# EAGLE design lipo-charger-station (EAGLE 6.3)

## Sheet 1 of 2
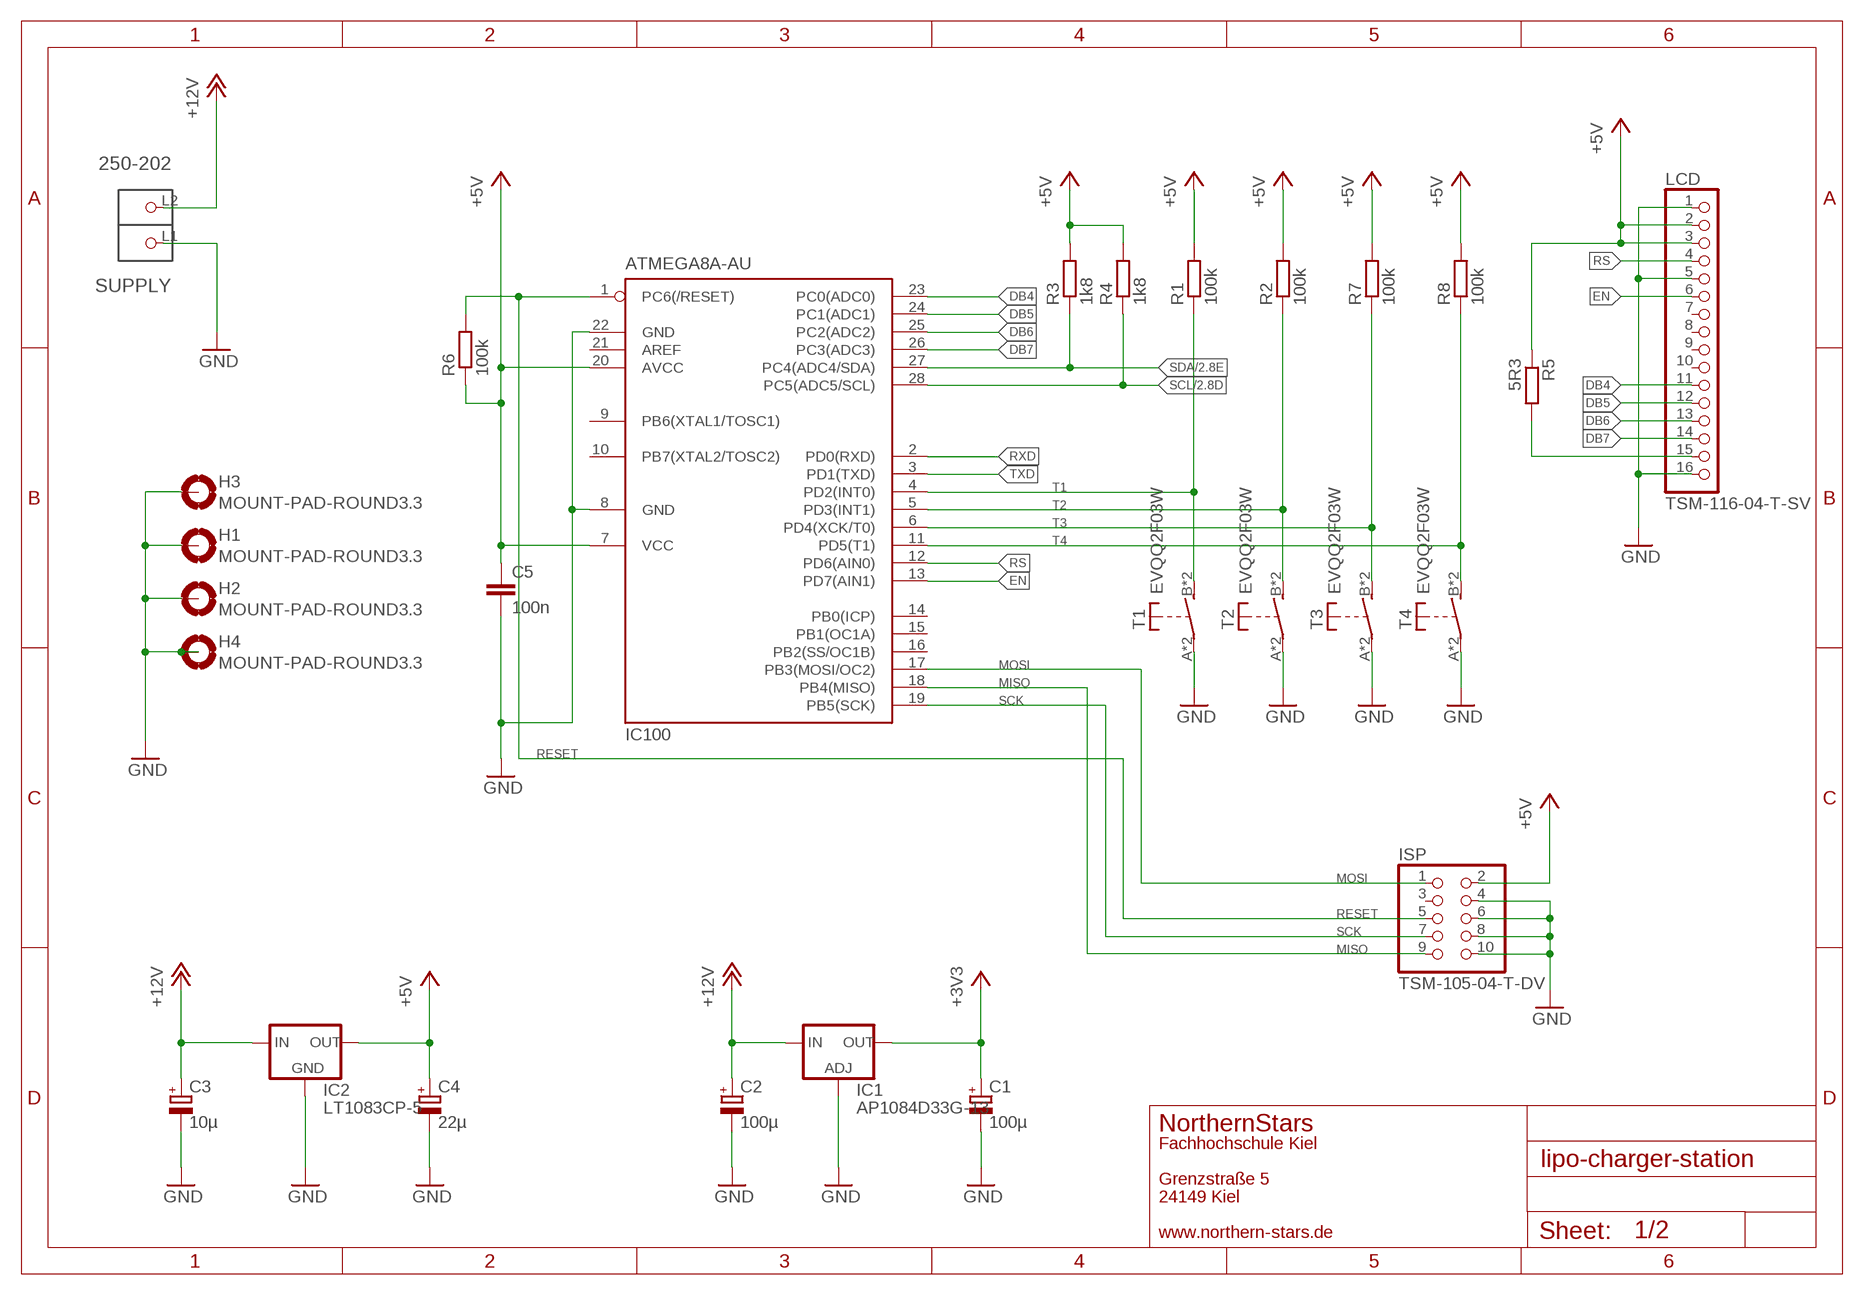
[diagram p0: schematic, sheet 1]

### Parts
C1  100µ  CPOL-EUG  [PANASONIC_G]
C2  100µ  CPOL-EUG  [PANASONIC_G]
C3  10µ  CPOL-EUD  [PANASONIC_D]
C4  22µ  CPOL-EUE  [PANASONIC_E]
C5  100n  C-EUC1206  [C1206]
H1  MOUNT-PAD-ROUND3.3  [3,3-PAD]
H2  MOUNT-PAD-ROUND3.3  [3,3-PAD]
H3  MOUNT-PAD-ROUND3.3  [3,3-PAD]
H4  MOUNT-PAD-ROUND3.3  [3,3-PAD]
IC1  AP1084D33G-13  AP1084  [TO252]
IC2  LT1083CP-5  LT108XCP  [TO3P]
IC100  ATMEGA8A-AU  MEGA8-P  [DIL28-3]
ISP  TSM-105-04-T-DV  PINHD-2X05_2.54-SMD  [2X05SMD]
LCD  TSM-116-04-T-SV  PINHD-1X16_2.54-SMD  [1X16SMD]
R1  100k  R-EU_R1206  [R1206]
R2  100k  R-EU_R1206  [R1206]
R3  1k8  R-EU_R1206  [R1206]
R4  1k8  R-EU_R1206  [R1206]
R5  5R3  R-EU_R1206  [R1206]
R6  100k  R-EU_R1206  [R1206]
R7  100k  R-EU_R1206  [R1206]
R8  100k  R-EU_R1206  [R1206]
SUPPLY  250-202  [P-250-202]
T1  EVQQ2F03W  SMD_TASTER_PANASONIC  [SMD_TASTER_PANASONIC]
T2  EVQQ2F03W  SMD_TASTER_PANASONIC  [SMD_TASTER_PANASONIC]
T3  EVQQ2F03W  SMD_TASTER_PANASONIC  [SMD_TASTER_PANASONIC]
T4  EVQQ2F03W  SMD_TASTER_PANASONIC  [SMD_TASTER_PANASONIC]

### Nets
+3V3: C1.+ IC1.3(OUT) ; also sheet 2
+5V: C4.+ C5.1 IC2.2(OUT) IC100.7(VCC) IC100.20(AVCC) ISP.2 LCD.2 LCD.3 R1.2 R2.2 R3.2 R4.2 R5.1 R6.1 R7.2 R8.2 ; also sheet 2
+12V: C2.+ C3.+ IC1.2(IN) IC2.3(IN) SUPPLY.L2(P2)
DB4: IC100.23(PC0(ADC0)) LCD.11
DB5: IC100.24(PC1(ADC1)) LCD.12
DB6: IC100.25(PC2(ADC2)) LCD.13
DB7: IC100.26(PC3(ADC3)) LCD.14
EN: IC100.13(PD7(AIN1)) LCD.6
GND: C1.- C2.- C3.- C4.- C5.2 H1.B3,3(MOUNT) H2.B3,3(MOUNT) H3.B3,3(MOUNT) H4.B3,3(MOUNT) IC1.1(ADJ) IC2.1(GND) IC100.8(GND) IC100.22(GND) ISP.4 ISP.6 ISP.8 ISP.10 LCD.1 LCD.5 LCD.16 SUPPLY.L1(P1) T1.A'(P) T1.A(P) T2.A'(P) T2.A(P) T3.A'(P) T3.A(P) T4.A'(P) T4.A(P) ; also sheet 2
LEDA: LCD.15 R5.2
MISO: IC100.18(PB4(MISO)) ISP.9
MOSI: IC100.17(PB3(MOSI/OC2)) ISP.1
RESET: IC100.1(PC6(/RESET)) ISP.5 R6.2
RS: IC100.12(PD6(AIN0)) LCD.4
RXD: IC100.2(PD0(RXD))
SCK: IC100.19(PB5(SCK)) ISP.7
SCL: IC100.28(PC5(ADC5/SCL)) R4.1 ; also sheet 2
SDA: IC100.27(PC4(ADC4/SDA)) R3.1 ; also sheet 2
T1: IC100.4(PD2(INT0)) R1.1 T1.B'(S) T1.B(S)
T2: IC100.5(PD3(INT1)) R2.1 T2.B'(S) T2.B(S)
T3: IC100.6(PD4(XCK/T0)) R7.1 T3.B'(S) T3.B(S)
T4: IC100.11(PD5(T1)) R8.1 T4.B'(S) T4.B(S)
TXD: IC100.3(PD1(TXD))
Unconnected: IC100.9(PB6(XTAL1/TOSC1)) IC100.10(PB7(XTAL2/TOSC2)) IC100.14(PB0(ICP)) IC100.15(PB1(OC1A)) IC100.16(PB2(SS/OC1B)) IC100.21(AREF) ISP.3 LCD.7 LCD.8 LCD.9 LCD.10

### Notes on the sheet
- NorthernStars
- Fachhochschule Kiel
- Grenzstraße 5
- 24149 Kiel
- www.northern-stars.de

## Sheet 2 of 2
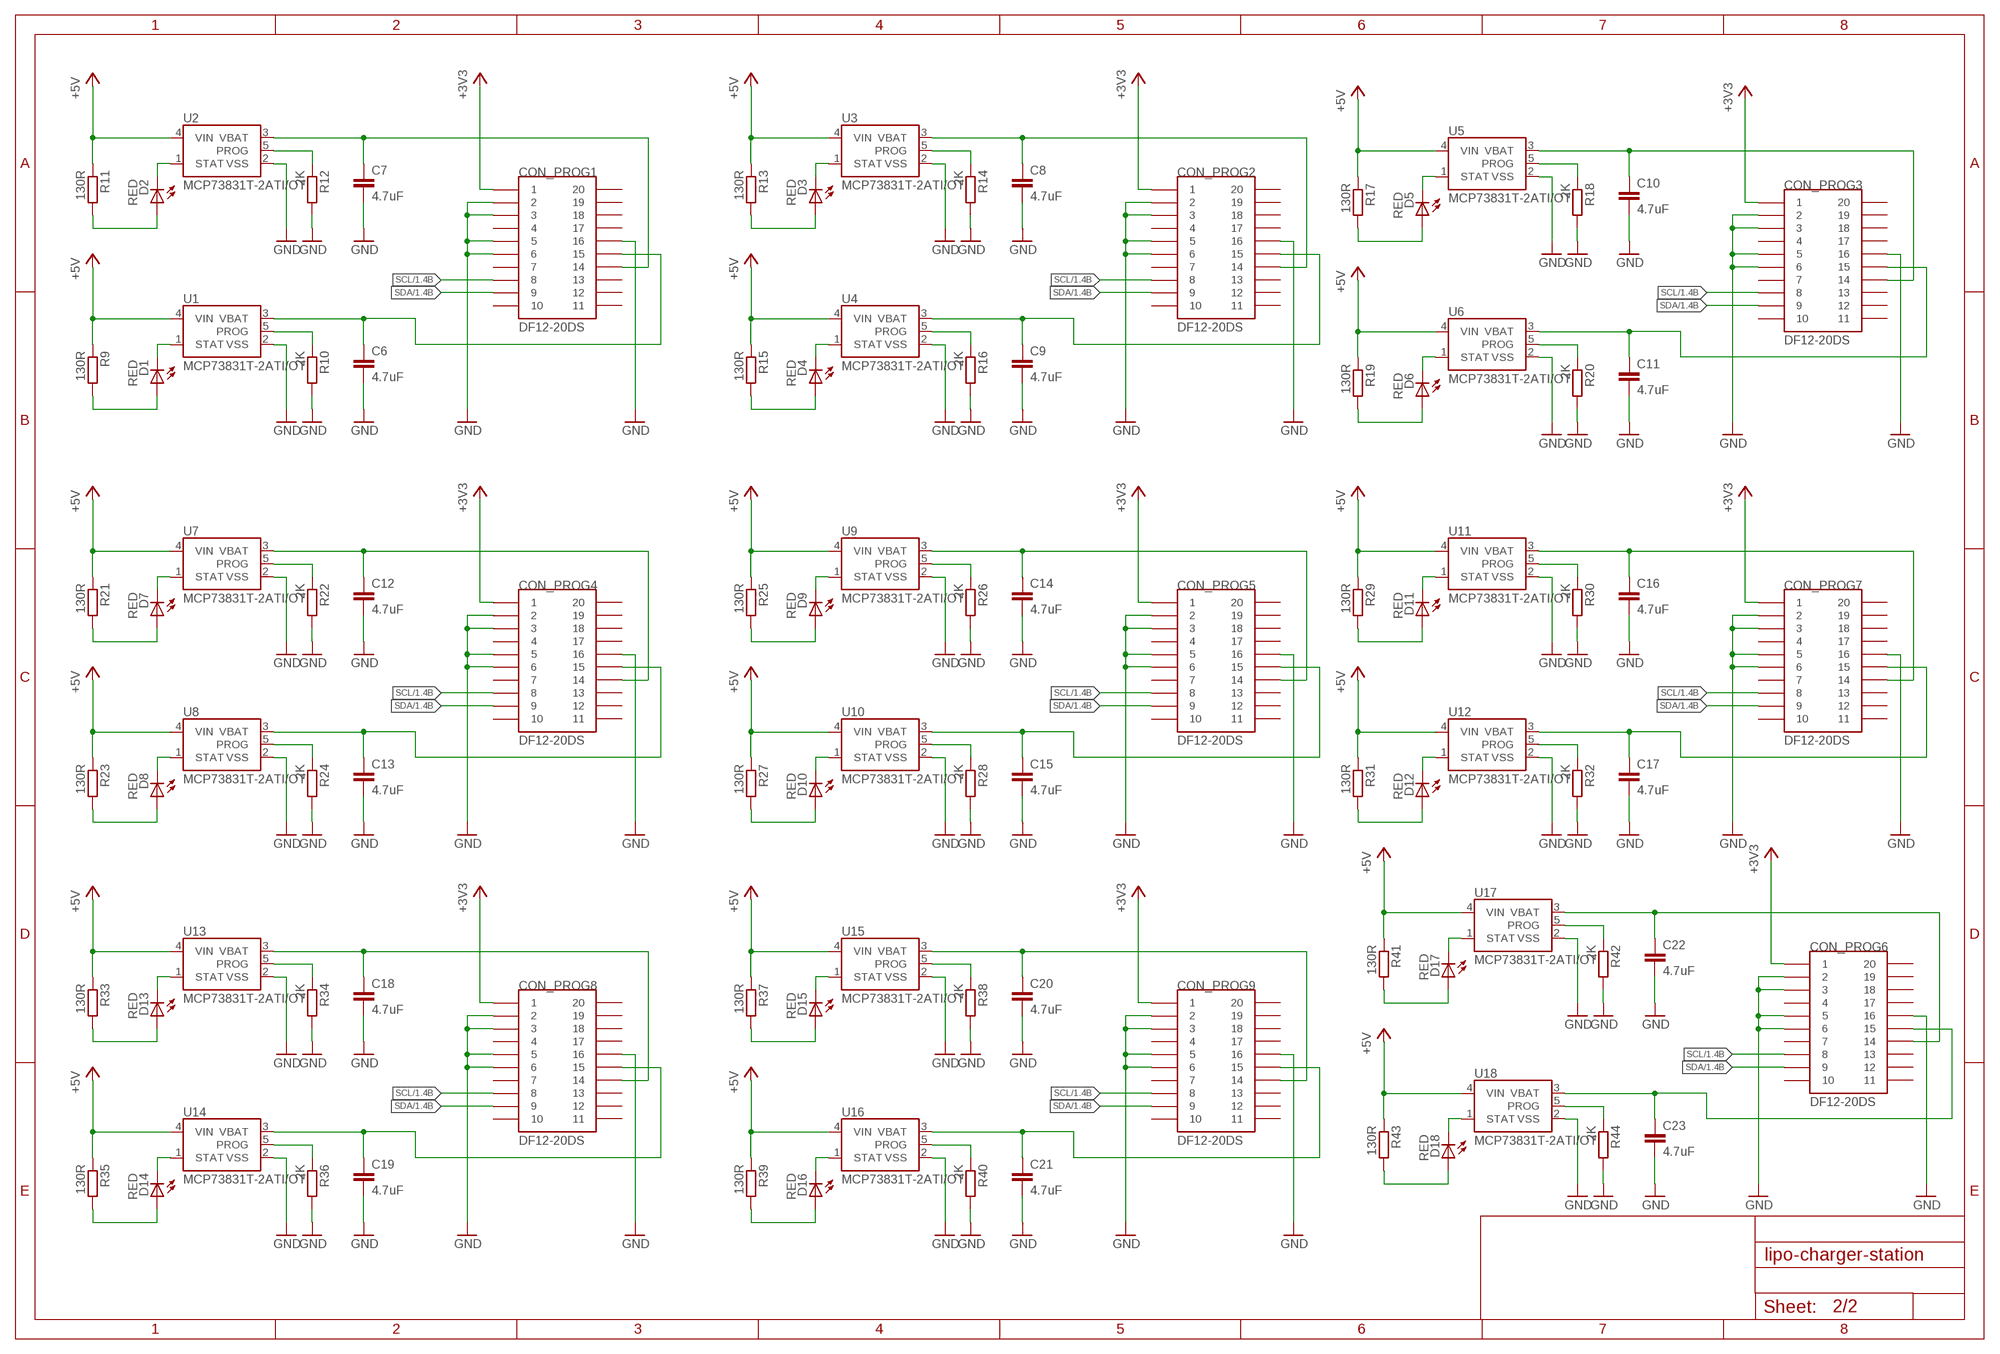
[diagram p1: schematic, sheet 2]

### Parts
C6  4.7uF  C-EUC1206  [C1206]
C7  4.7uF  C-EUC1206  [C1206]
C8  4.7uF  C-EUC1206  [C1206]
C9  4.7uF  C-EUC1206  [C1206]
C10  4.7uF  C-EUC1206  [C1206]
C11  4.7uF  C-EUC1206  [C1206]
C12  4.7uF  C-EUC1206  [C1206]
C13  4.7uF  C-EUC1206  [C1206]
C14  4.7uF  C-EUC1206  [C1206]
C15  4.7uF  C-EUC1206  [C1206]
C16  4.7uF  C-EUC1206  [C1206]
C17  4.7uF  C-EUC1206  [C1206]
C18  4.7uF  C-EUC1206  [C1206]
C19  4.7uF  C-EUC1206  [C1206]
C20  4.7uF  C-EUC1206  [C1206]
C21  4.7uF  C-EUC1206  [C1206]
C22  4.7uF  C-EUC1206  [C1206]
C23  4.7uF  C-EUC1206  [C1206]
CON_PROG1  DF12-20DS  [DF12-20DS]
CON_PROG2  DF12-20DS  [DF12-20DS]
CON_PROG3  DF12-20DS  [DF12-20DS]
CON_PROG4  DF12-20DS  [DF12-20DS]
CON_PROG5  DF12-20DS  [DF12-20DS]
CON_PROG6  DF12-20DS  [DF12-20DS]
CON_PROG7  DF12-20DS  [DF12-20DS]
CON_PROG8  DF12-20DS  [DF12-20DS]
CON_PROG9  DF12-20DS  [DF12-20DS]
D1  RED  LEDCHIPLED_1206  [CHIPLED_1206]
D2  RED  LEDCHIPLED_1206  [CHIPLED_1206]
D3  RED  LEDCHIPLED_1206  [CHIPLED_1206]
D4  RED  LEDCHIPLED_1206  [CHIPLED_1206]
D5  RED  LEDCHIPLED_1206  [CHIPLED_1206]
D6  RED  LEDCHIPLED_1206  [CHIPLED_1206]
D7  RED  LEDCHIPLED_1206  [CHIPLED_1206]
D8  RED  LEDCHIPLED_1206  [CHIPLED_1206]
D9  RED  LEDCHIPLED_1206  [CHIPLED_1206]
D10  RED  LEDCHIPLED_1206  [CHIPLED_1206]
D11  RED  LEDCHIPLED_1206  [CHIPLED_1206]
D12  RED  LEDCHIPLED_1206  [CHIPLED_1206]
D13  RED  LEDCHIPLED_1206  [CHIPLED_1206]
D14  RED  LEDCHIPLED_1206  [CHIPLED_1206]
D15  RED  LEDCHIPLED_1206  [CHIPLED_1206]
D16  RED  LEDCHIPLED_1206  [CHIPLED_1206]
D17  RED  LEDCHIPLED_1206  [CHIPLED_1206]
D18  RED  LEDCHIPLED_1206  [CHIPLED_1206]
R9  130R  R-EU_R1206  [R1206]
R10  2K  R-EU_R1206  [R1206]
R11  130R  R-EU_R1206  [R1206]
R12  2K  R-EU_R1206  [R1206]
R13  130R  R-EU_R1206  [R1206]
R14  2K  R-EU_R1206  [R1206]
R15  130R  R-EU_R1206  [R1206]
R16  2K  R-EU_R1206  [R1206]
R17  130R  R-EU_R1206  [R1206]
R18  2K  R-EU_R1206  [R1206]
R19  130R  R-EU_R1206  [R1206]
R20  2K  R-EU_R1206  [R1206]
R21  130R  R-EU_R1206  [R1206]
R22  2K  R-EU_R1206  [R1206]
R23  130R  R-EU_R1206  [R1206]
R24  2K  R-EU_R1206  [R1206]
R25  130R  R-EU_R1206  [R1206]
R26  2K  R-EU_R1206  [R1206]
R27  130R  R-EU_R1206  [R1206]
R28  2K  R-EU_R1206  [R1206]
R29  130R  R-EU_R1206  [R1206]
R30  2K  R-EU_R1206  [R1206]
R31  130R  R-EU_R1206  [R1206]
R32  2K  R-EU_R1206  [R1206]
R33  130R  R-EU_R1206  [R1206]
R34  2K  R-EU_R1206  [R1206]
R35  130R  R-EU_R1206  [R1206]
R36  2K  R-EU_R1206  [R1206]
R37  130R  R-EU_R1206  [R1206]
R38  2K  R-EU_R1206  [R1206]
R39  130R  R-EU_R1206  [R1206]
R40  2K  R-EU_R1206  [R1206]
R41  130R  R-EU_R1206  [R1206]
R42  2K  R-EU_R1206  [R1206]
R43  130R  R-EU_R1206  [R1206]
R44  2K  R-EU_R1206  [R1206]
U1  MCP73831T-2ATI/OT  MCP73831  [SOT23-5]
U2  MCP73831T-2ATI/OT  MCP73831  [SOT23-5]
U3  MCP73831T-2ATI/OT  MCP73831  [SOT23-5]
U4  MCP73831T-2ATI/OT  MCP73831  [SOT23-5]
U5  MCP73831T-2ATI/OT  MCP73831  [SOT23-5]
U6  MCP73831T-2ATI/OT  MCP73831  [SOT23-5]
U7  MCP73831T-2ATI/OT  MCP73831  [SOT23-5]
U8  MCP73831T-2ATI/OT  MCP73831  [SOT23-5]
U9  MCP73831T-2ATI/OT  MCP73831  [SOT23-5]
U10  MCP73831T-2ATI/OT  MCP73831  [SOT23-5]
U11  MCP73831T-2ATI/OT  MCP73831  [SOT23-5]
U12  MCP73831T-2ATI/OT  MCP73831  [SOT23-5]
U13  MCP73831T-2ATI/OT  MCP73831  [SOT23-5]
U14  MCP73831T-2ATI/OT  MCP73831  [SOT23-5]
U15  MCP73831T-2ATI/OT  MCP73831  [SOT23-5]
U16  MCP73831T-2ATI/OT  MCP73831  [SOT23-5]
U17  MCP73831T-2ATI/OT  MCP73831  [SOT23-5]
U18  MCP73831T-2ATI/OT  MCP73831  [SOT23-5]

### Nets
+3V3: CON_PROG1.1 CON_PROG2.1 CON_PROG3.1 CON_PROG4.1 CON_PROG5.1 CON_PROG6.1 CON_PROG7.1 CON_PROG8.1 CON_PROG9.1 ; also sheet 1
+5V: R9.1 R11.1 R13.1 R15.1 R17.1 R19.1 R21.1 R23.1 R25.1 R27.1 R29.1 R31.1 R33.1 R35.1 R37.1 R39.1 R41.1 R43.1 U1.4(VIN) U2.4(VIN) U3.4(VIN) U4.4(VIN) U5.4(VIN) U6.4(VIN) U7.4(VIN) U8.4(VIN) U9.4(VIN) U10.4(VIN) U11.4(VIN) U12.4(VIN) U13.4(VIN) U14.4(VIN) U15.4(VIN) U16.4(VIN) U17.4(VIN) U18.4(VIN) ; also sheet 1
B1_BAT1+: C7.1 CON_PROG1.14 U2.3(VBAT)
B1_BAT1+1: C8.1 CON_PROG2.14 U3.3(VBAT)
B1_BAT1+3: C10.1 CON_PROG3.14 U5.3(VBAT)
B1_BAT1+4: C12.1 CON_PROG4.14 U7.3(VBAT)
B1_BAT1+5: C16.1 CON_PROG7.14 U11.3(VBAT)
B1_BAT1+6: C14.1 CON_PROG5.14 U9.3(VBAT)
B1_BAT1+7: C22.1 CON_PROG6.14 U17.3(VBAT)
B1_BAT1+9: C18.1 CON_PROG8.14 U13.3(VBAT)
B1_BAT1+10: C20.1 CON_PROG9.14 U15.3(VBAT)
B1_BAT2+: C6.1 CON_PROG1.15 U1.3(VBAT)
B1_BAT2+1: C9.1 CON_PROG2.15 U4.3(VBAT)
B1_BAT2+2: C11.1 CON_PROG3.15 U6.3(VBAT)
B1_BAT2+3: C13.1 CON_PROG4.15 U8.3(VBAT)
B1_BAT2+4: C15.1 CON_PROG5.15 U10.3(VBAT)
B1_BAT2+5: C17.1 CON_PROG7.15 U12.3(VBAT)
B1_BAT2+6: C19.1 CON_PROG8.15 U14.3(VBAT)
B1_BAT2+7: C21.1 CON_PROG9.15 U16.3(VBAT)
B1_BAT2+8: C23.1 CON_PROG6.15 U18.3(VBAT)
GND: C6.2 C7.2 C8.2 C9.2 C10.2 C11.2 C12.2 C13.2 C14.2 C15.2 C16.2 C17.2 C18.2 C19.2 C20.2 C21.2 C22.2 C23.2 CON_PROG1.2 CON_PROG1.3 CON_PROG1.5 CON_PROG1.6 CON_PROG1.16 CON_PROG2.2 CON_PROG2.3 CON_PROG2.5 CON_PROG2.6 CON_PROG2.16 CON_PROG3.2 CON_PROG3.3 CON_PROG3.5 CON_PROG3.6 CON_PROG3.16 CON_PROG4.2 CON_PROG4.3 CON_PROG4.5 CON_PROG4.6 CON_PROG4.16 CON_PROG5.2 CON_PROG5.3 CON_PROG5.5 CON_PROG5.6 CON_PROG5.16 CON_PROG6.2 CON_PROG6.3 CON_PROG6.5 CON_PROG6.6 CON_PROG6.16 CON_PROG7.2 CON_PROG7.3 CON_PROG7.5 CON_PROG7.6 CON_PROG7.16 CON_PROG8.2 CON_PROG8.3 CON_PROG8.5 CON_PROG8.6 CON_PROG8.16 CON_PROG9.2 CON_PROG9.3 CON_PROG9.5 CON_PROG9.6 CON_PROG9.16 R10.2 R12.2 R14.2 R16.2 R18.2 R20.2 R22.2 R24.2 R26.2 R28.2 R30.2 R32.2 R34.2 R36.2 R38.2 R40.2 R42.2 R44.2 U1.2(VSS) U2.2(VSS) U3.2(VSS) U4.2(VSS) U5.2(VSS) U6.2(VSS) U7.2(VSS) U8.2(VSS) U9.2(VSS) U10.2(VSS) U11.2(VSS) U12.2(VSS) U13.2(VSS) U14.2(VSS) U15.2(VSS) U16.2(VSS) U17.2(VSS) U18.2(VSS) ; also sheet 1
N$1: D2.A R11.2
N$2: D1.A R9.2
N$3: D3.A R13.2
N$4: D4.A R15.2
N$5: D5.A R17.2
N$6: D6.A R19.2
N$7: D7.A R21.2
N$8: D8.A R23.2
N$9: D9.A R25.2
N$10: D10.A R27.2
N$11: D11.A R29.2
N$12: D12.A R31.2
N$13: D13.A R33.2
N$14: D14.A R35.2
N$15: D15.A R37.2
N$16: D16.A R39.2
N$17: D17.A R41.2
N$18: D18.A R43.2
PROG: R12.1 U2.5(PROG)
PROG1: R10.1 U1.5(PROG)
PROG2: R14.1 U3.5(PROG)
PROG3: R16.1 U4.5(PROG)
PROG4: R18.1 U5.5(PROG)
PROG5: R20.1 U6.5(PROG)
PROG6: R22.1 U7.5(PROG)
PROG7: R24.1 U8.5(PROG)
PROG8: R26.1 U9.5(PROG)
PROG9: R28.1 U10.5(PROG)
PROG10: R30.1 U11.5(PROG)
PROG11: R32.1 U12.5(PROG)
PROG12: R34.1 U13.5(PROG)
PROG13: R36.1 U14.5(PROG)
PROG14: R38.1 U15.5(PROG)
PROG15: R40.1 U16.5(PROG)
PROG16: R42.1 U17.5(PROG)
PROG17: R44.1 U18.5(PROG)
SCL: CON_PROG1.8 CON_PROG2.8 CON_PROG3.8 CON_PROG4.8 CON_PROG5.8 CON_PROG6.8 CON_PROG7.8 CON_PROG8.8 CON_PROG9.8 ; also sheet 1
SDA: CON_PROG1.9 CON_PROG2.9 CON_PROG3.9 CON_PROG4.9 CON_PROG5.9 CON_PROG6.9 CON_PROG7.9 CON_PROG8.9 CON_PROG9.9 ; also sheet 1
STAT: D2.C U2.1(STAT)
STAT1: D1.C U1.1(STAT)
STAT2: D3.C U3.1(STAT)
STAT3: D4.C U4.1(STAT)
STAT4: D5.C U5.1(STAT)
STAT5: D6.C U6.1(STAT)
STAT6: D7.C U7.1(STAT)
STAT7: D8.C U8.1(STAT)
STAT8: D9.C U9.1(STAT)
STAT9: D10.C U10.1(STAT)
STAT10: D11.C U11.1(STAT)
STAT11: D12.C U12.1(STAT)
STAT12: D13.C U13.1(STAT)
STAT13: D14.C U14.1(STAT)
STAT14: D15.C U15.1(STAT)
STAT15: D16.C U16.1(STAT)
STAT16: D17.C U17.1(STAT)
STAT17: D18.C U18.1(STAT)
Unconnected: CON_PROG1.4 CON_PROG1.7 CON_PROG1.10 CON_PROG1.11 CON_PROG1.12 CON_PROG1.13 CON_PROG1.17 CON_PROG1.18 CON_PROG1.19 CON_PROG1.20 CON_PROG2.4 CON_PROG2.7 CON_PROG2.10 CON_PROG2.11 CON_PROG2.12 CON_PROG2.13 CON_PROG2.17 CON_PROG2.18 CON_PROG2.19 CON_PROG2.20 CON_PROG3.4 CON_PROG3.7 CON_PROG3.10 CON_PROG3.11 CON_PROG3.12 CON_PROG3.13 CON_PROG3.17 CON_PROG3.18 CON_PROG3.19 CON_PROG3.20 CON_PROG4.4 CON_PROG4.7 CON_PROG4.10 CON_PROG4.11 CON_PROG4.12 CON_PROG4.13 CON_PROG4.17 CON_PROG4.18 CON_PROG4.19 CON_PROG4.20 CON_PROG5.4 CON_PROG5.7 CON_PROG5.10 CON_PROG5.11 CON_PROG5.12 CON_PROG5.13 CON_PROG5.17 CON_PROG5.18 CON_PROG5.19 CON_PROG5.20 CON_PROG6.4 CON_PROG6.7 CON_PROG6.10 CON_PROG6.11 CON_PROG6.12 CON_PROG6.13 CON_PROG6.17 CON_PROG6.18 CON_PROG6.19 CON_PROG6.20 CON_PROG7.4 CON_PROG7.7 CON_PROG7.10 CON_PROG7.11 CON_PROG7.12 CON_PROG7.13 CON_PROG7.17 CON_PROG7.18 CON_PROG7.19 CON_PROG7.20 CON_PROG8.4 CON_PROG8.7 CON_PROG8.10 CON_PROG8.11 CON_PROG8.12 CON_PROG8.13 CON_PROG8.17 CON_PROG8.18 CON_PROG8.19 CON_PROG8.20 CON_PROG9.4 CON_PROG9.7 CON_PROG9.10 CON_PROG9.11 CON_PROG9.12 CON_PROG9.13 CON_PROG9.17 CON_PROG9.18 CON_PROG9.19 CON_PROG9.20

## Library data of the parts
C1-C4 = rcl:CPOL-EU: POLARIZED CAPACITOR, European symbol
C5-C23 = rcl:C-EU: CAPACITOR, European symbol
CON_PROG1-CON_PROG9 = con-hirose:DF12-20: HRS-Hirose DF12-Series 0.5mm Pitch SMT Board to Board Connector 20 contacts
D1-D18 = led:LED: LED OSRAM: - CHIPLED LG R971, LG N971, LY N971, LG Q971, LY Q971, LO R971, LY R971 LH N974, LH R974 LS Q976, LO Q976, LY Q976 LO Q996 - Hyper CHIPLED LW Q18S LB Q993, LB Q99A, LB R99A - SideLED LS A670, LO A670, LY A670, LG A670, LP A670 LB A673, LV A673, LT A673, LW A673 LH A674 LY A675 LS A676, LA A676, LO A676, LY A676, LW A676 LS A679, LY A679, LG A679 - Hyper Micro SIDELED® LS Y876, LA Y876, LO Y876, LY Y876 LT Y87S - SmartLED LW L88C, LW L88S LB L89C, LB L89S, LG L890 LS L89K, LO L89K, LY L89K LS L896, LA L896, LO L896, LY L896 - TOPLED LS T670, LO T670, LY T670, LG T670, LP T670 LSG T670, LSP T670, LSY T670, LOP T670, LYG T670 LG T671, LOG T671, LSG T671 LB T673, LV T673, LT T673, LW T673 LH T674 LS T676, LA T676, LO T676, LY T676, LB T676, LH T676, LSB T676, LW T676 LB T67C, LV T67C, LT T67C, LS T67K, LO T67K, LY T67K, LW E67C LS E67B, LA E67B, LO E67B, LY E67B, LB E67C, LV E67C, LT E67C LW T67C LS T679, LY T679, LG T679 LS T770, LO T770, LY T770, LG T770, LP T770 LB T773, LV T773, LT T773, LW T773 LH T774 LS E675, LA E675, LY E675, LS T675 LS T776, LA T776, LO T776, LY T776, LB T776 LHGB T686 LT T68C, LB T68C - Hyper Mini TOPLED® LB M676 - Mini TOPLED Santana® LG M470 LS M47K, LO M47K, LY M47K Source: http://www.osram.convergy.de LUXEON: - LUMILED® LXK2-PW12-R00, LXK2-PW12-S00, LXK2-PW14-U00, LXK2-PW14-V00 LXK2-PM12-R00, LXK2-PM12-S00, LXK2-PM14-U00 LXK2-PE12-Q00, LXK2-PE12-R00, LXK2-PE12-S00, LXK2-PE14-T00, LXK2-PE14-U00 LXK2-PB12-K00, LXK2-PB12-L00, LXK2-PB12-M00, LXK2-PB14-N00, LXK2-PB14-P00, LXK2-PB14-Q00 LXK2-PR12-L00, LXK2-PR12-M00, LXK2-PR14-Q00, LXK2-PR14-R00 LXK2-PD12-Q00, LXK2-PD12-R00, LXK2-PD12-S00 LXK2-PH12-R00, LXK2-PH12-S00 LXK2-PL12-P00, LXK2-PL12-Q00, LXK2-PL12-R00 Source: www.luxeon.com KINGBRIGHT: KA-3528ASYC Source: www.kingbright.com
H1-H4 = holes:MOUNT-PAD-ROUND: MOUNTING PAD, round
IC1 = v-reg-3:AP1084: AP1084 5A LOW DROPOUT POSITIVE ADJUSTABLE OR FIXED-MODE REGULATOR
IC2 = v-reg-3:LT108X: LT108X 3A, 5A, 7.5A Low Dropout Positive Fixed Regulators
IC100 = atmel:MEGA8-P: MICROCONTROLLER 8 Kbytes FLASH, 1 kbytes SRAM, 512 bytes EEPROM, USART, 4-channel 10 bit ADC, 2-channel 8 bit ADC Pin compatible with Atmega48, ATMega88, ATMega168 Source: avr.lbr
ISP = pinhead-2:PINHD-2X05: PIN HEADER
LCD = pinhead-2:PINHD-1X16: PIN HEADER
R1-R44 = rcl:R-EU_: RESISTOR, European symbol
SUPPLY = con-wago_250:250-202: Serie 250, 1-Leiter-Klemmenleiste für Leiterplatten 1 Lötstift/Pol versetzt / Series 250, 1-conductor PCB terminal strip 1 solder pin/pole, staggered Polzahl / Pole No.: 2 Rastermaß / Pitch: 3.5 mm Bemessungsspannung / Rated Voltage: 320 V Nennstrom / Nominal Current: 8 A Leiterquerschnitt / Conductor Size: 0.2 - 1.5 mm² Anschlusstechnik / Connection Technology: Steckklemm-Anschluss Lötstiftlänge: / Solder Pin Length: 3.6 mm Leitereinführung (zur Platine) / Conductor entry angle (to PCB): 45 ° Farbe / Color: grau / gray Stand: 01.01.2012. Die jeweils aktuellen Daten zu diesem Artikel finden Sie in unserem Produktkatalog, den Sie unter www.wago.com einsehen können. As of: 01/01/2012. Please find the newest data for this article in our product catalogue, which can be viewed under www.wago.com.
T1-T4 = switch-misc:SMD_TASTER: SMD Taster Aus einer Distronic H-Tron plus V100 Width: 3mm Length: 3mm SMD Taster Panasonic EVQQ2F03W; DEVICE: EVQQ2F03W
U1-U18 = SparkFun:MCP73831: Microchip's MCP73831 Miniature single cell, fully integrated Li-Ion, Li-polymer charge management controller http://ww1.microchip.com/downloads/en/DeviceDoc/21984a.pdf

## Board
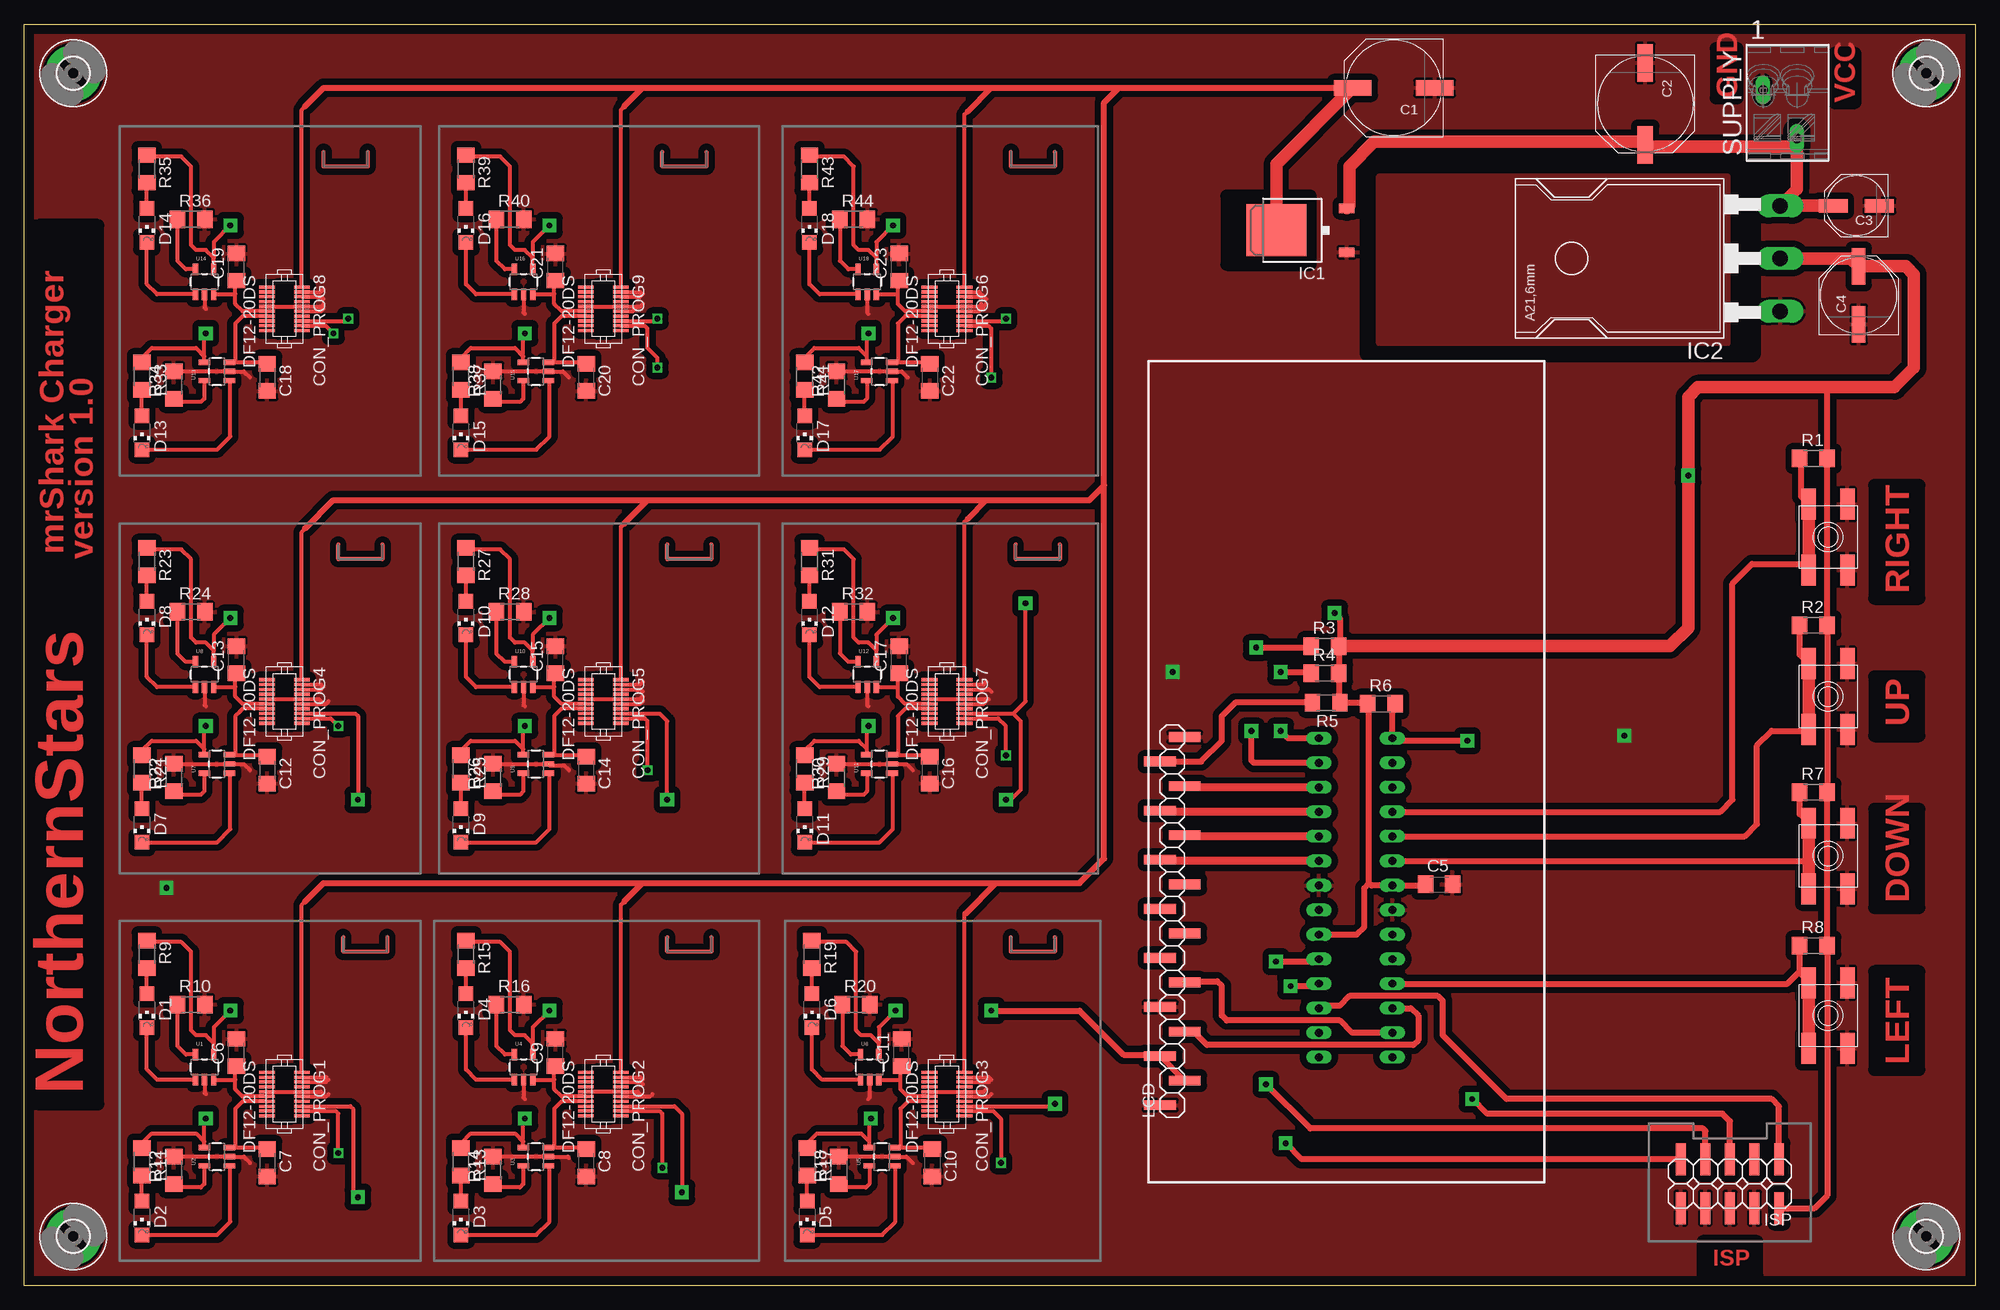
[diagram p2: board, top side]
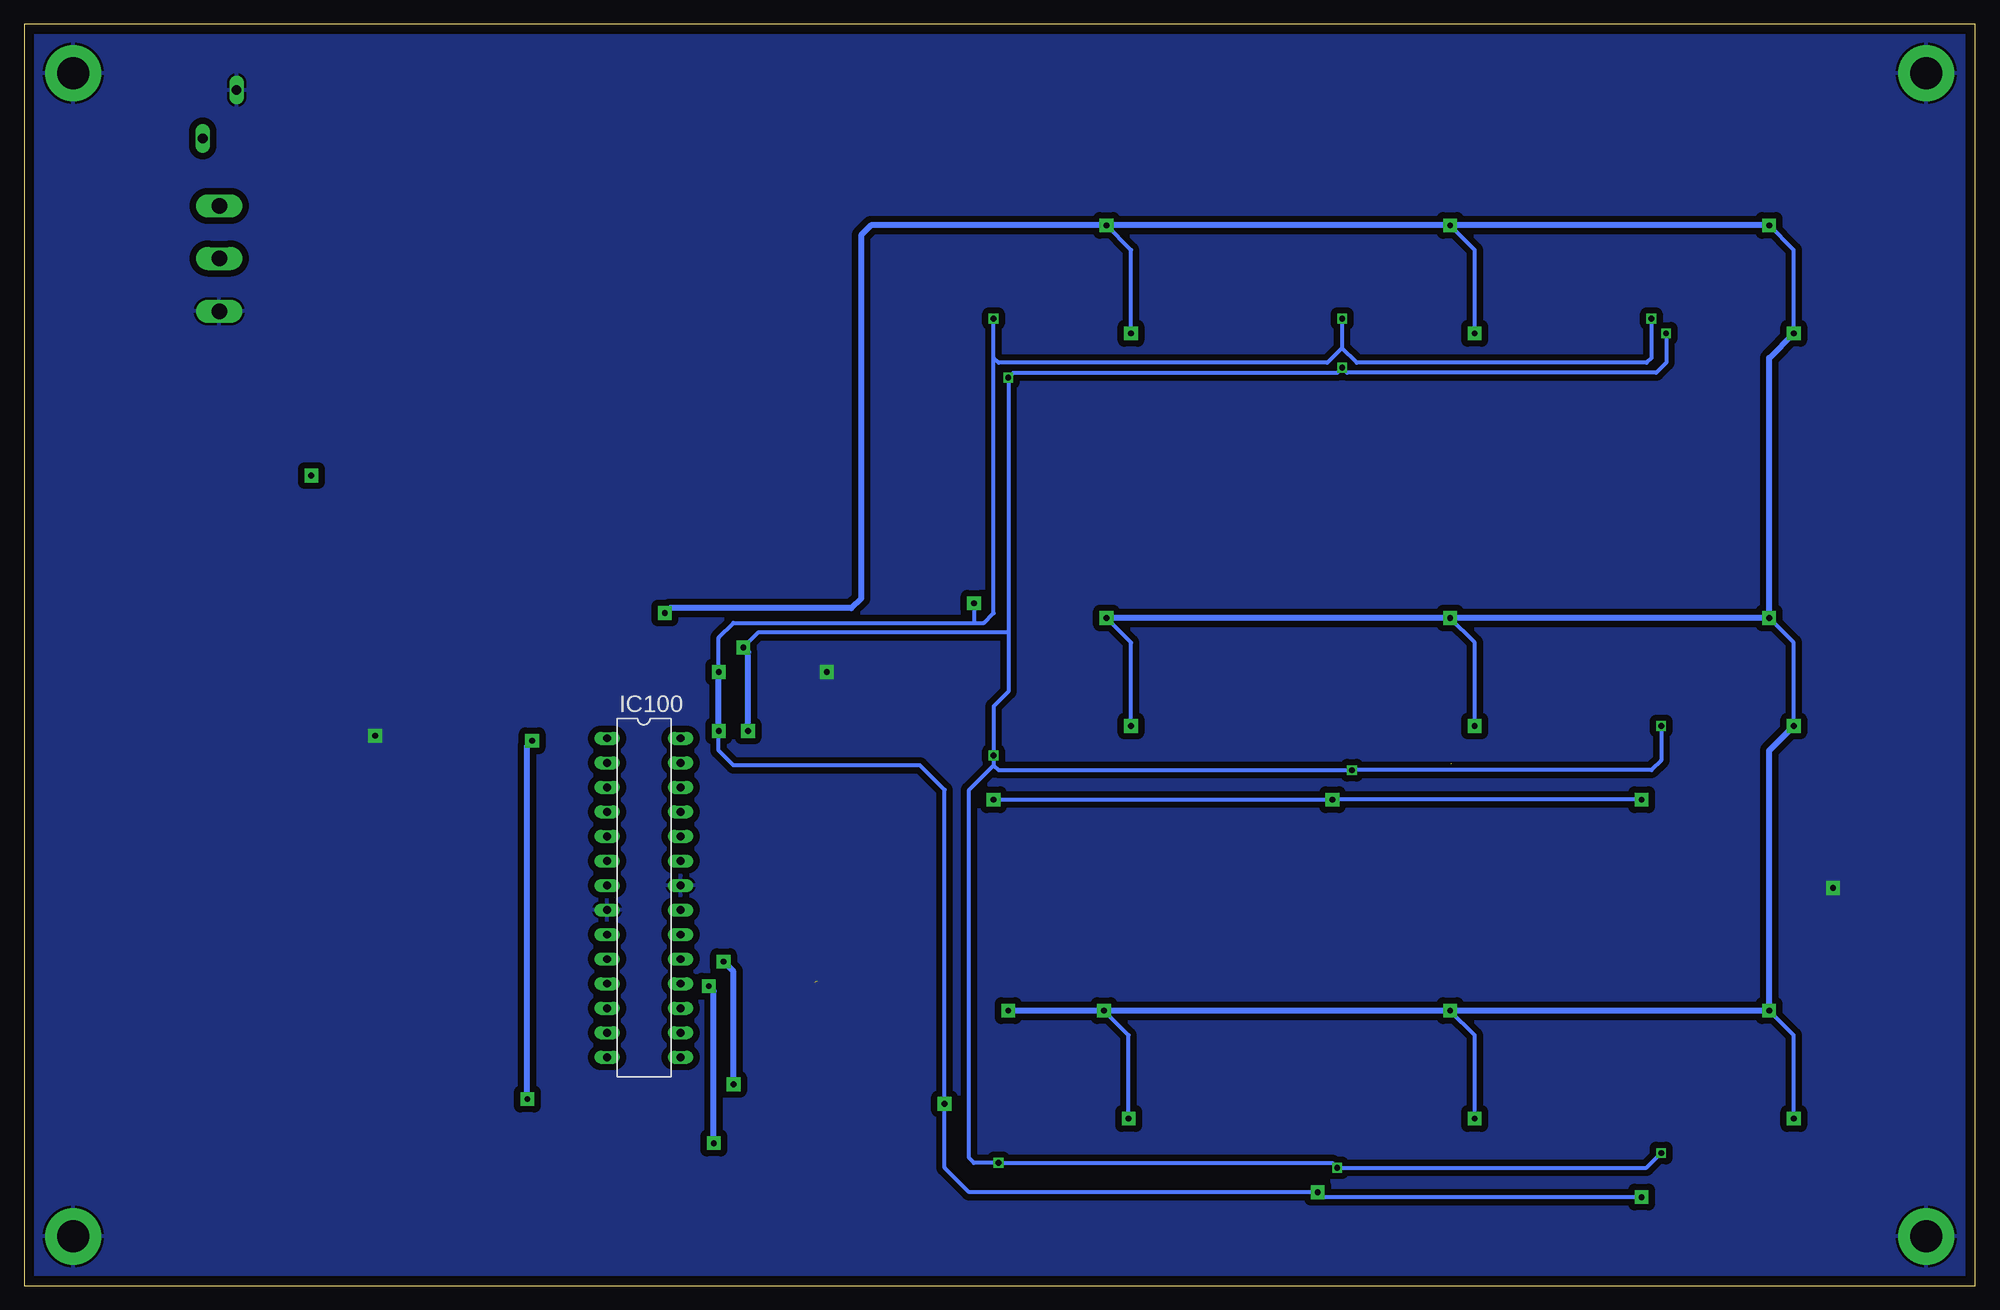
[diagram p3: board, bottom side, seen from below]

Size 201.93 x 130.56 mm. Coordinates in mm from the lower left corner, seen from the top.
Outline: 0,0 0,130.56 201.93,130.56 201.93,0 0,0
Copper layers (1*16): Top 0.035mm / dielectric 1.5mm / Bottom 0.035mm
Design rules "default": minimum track width 10mil, minimum drill 24mil, track to track 8mil, track to pad 8mil, pad to pad 8mil, via to via 8mil, smd to smd 8mil, copper to edge 40mil, drill to drill 8mil, minimum pad ring 10mil, minimum via ring 8mil, stop-mask expansion 4mil, vias tented up to drill 0mil, thermal gap 10mil
tRestrict: area 1.5,18.8 to 7.6,109.7; area 173.7,1 to 179.3,4.6; area 191.5,22.4 to 196.1,32.5; area 191.5,39.1 to 196.1,49.3; area 191.5,56.9 to 196.1,63; area 191.5,71.1 to 196.1,82.8; area 124.5,105.7 to 133.1,112.8; 4 lines

### Footprints (pad centres in the part's own frame; a part is rotated, then mirrored left to right if it is on the bottom)
PANASONIC_G = smd 3.9 x 1.6: + 4.25,0; - -4.25,0
PANASONIC_D = smd 3 x 1.4: + 2.4,0; - -2.4,0
PANASONIC_E = smd 3.8 x 1.4: + 3,0; - -3,0
C1206 = smd 1.6 x 1.8: 1 -1.4,0; 2 1.4,0
DF12-20DS = smd 0.32 x 1.62: 1 -2.25,1.81; 2 -1.75,1.81; 3 -1.25,1.81; 4 -0.75,1.81; 5 -0.25,1.81; 6 0.25,1.81; 7 0.75,1.81; 8 1.25,1.81; 9 1.75,1.81; 10 2.25,1.81; 11 2.25,-1.81; 12 1.75,-1.81; 13 1.25,-1.81; 14 0.75,-1.81; 15 0.25,-1.81; 16 -0.25,-1.81; 17 -0.75,-1.81; 18 -1.25,-1.81; 19 -1.75,-1.81; 20 -2.25,-1.81
CHIPLED_1206 = smd 1.5 x 1.5: A 0,-1.75; C 0,1.75
3,3-PAD = drill 3.3 pad 5.842: B3,3 0,0
TO252 = smd 1 x 1.6: 1 -2.28,-6.07; 2 2.28,-6.07 | smd 5.4 x 6.2: 3 0,1.23
TO3P = drill 1.6 long: 1 -5.46,-15.24; 2 0,-15.24; 3 5.46,-15.24
DIL28-3 = drill 0.813 long: 1 -16.51,-3.81; 2 -13.97,-3.81; 3 -11.43,-3.81; 4 -8.89,-3.81; 5 -6.35,-3.81; 6 -3.81,-3.81; 7 -1.27,-3.81; 8 1.27,-3.81; 9 3.81,-3.81; 10 6.35,-3.81; 11 8.89,-3.81; 12 11.43,-3.81; 13 13.97,-3.81; 14 16.51,-3.81; 15 16.51,3.81; 16 13.97,3.81; 17 11.43,3.81; 18 8.89,3.81; 19 6.35,3.81; 20 3.81,3.81; 21 1.27,3.81; 22 -1.27,3.81; 23 -3.81,3.81; 24 -6.35,3.81; 25 -8.89,3.81; 26 -11.43,3.81; 27 -13.97,3.81; 28 -16.51,3.81
2X05SMD = smd 1.016 x 3.302: 1 -1.27,-3.81; 2 -1.27,1.27; 3 1.27,-3.81; 4 1.27,1.27; 5 3.81,-3.81; 6 3.81,1.27; 7 6.35,-3.81; 8 6.35,1.27; 9 8.89,-3.81; 10 8.89,1.27
1X16SMD = smd 1.016 x 3.302: 1 -1.27,1.27; 2 1.27,-1.27; 3 3.81,1.27; 4 6.35,-1.27; 5 8.89,1.27; 6 11.43,-1.27; 7 13.97,1.27; 8 16.51,-1.27; 9 19.05,1.27; 10 21.59,-1.27; 11 24.13,1.27; 12 26.67,-1.27; 13 29.21,1.27; 14 31.75,-1.27; 15 34.29,1.27; 16 36.83,-1.27
R1206 = smd 1.6 x 1.803: 1 -1.422,0; 2 1.422,0
P-250-202 = drill 1 long: L1 1.3,2.55; L2 -3.7,-0.95
SMD_TASTER_PANASONIC = smd 3.2 x 1.5: A -3.4,-2; A' 3.4,-2; B -3.4,2; B' 3.4,2
SOT23-5 = smd 0.55 x 1.2: 1 -0.95,-1.3; 2 0,-1.3; 3 0.95,-1.3; 4 0.95,1.3; 5 -0.95,1.3

### Placement (x,y rotation side)
C1  141.73,123.95 180 top
C2  167.77,122.3 270 top
C3  189.61,111.76 180 top
C4  189.87,102.49 90 top
C5  146.43,41.53 0 top
C6  21.97,24.13 90 top
C7  25.15,12.7 270 top
C8  58.17,12.7 270 top
C9  54.99,24.13 90 top
C10  93.98,12.7 270 top
C11  90.81,24.13 90 top
C12  25.15,53.34 270 top
C13  21.97,64.77 90 top
C14  58.17,53.34 270 top
C15  54.99,64.77 90 top
C16  93.73,53.34 270 top
C17  90.55,64.77 90 top
C18  25.15,93.98 270 top
C19  21.97,105.41 90 top
C20  58.17,93.98 270 top
C21  54.99,105.41 90 top
C22  93.73,93.98 270 top
C23  90.55,105.41 90 top
CON_PROG1  26.92,19.81 270 top
CON_PROG2  59.94,19.81 270 top
CON_PROG3  95.5,19.81 270 top
CON_PROG4  26.92,60.45 270 top
CON_PROG5  59.94,60.45 270 top
CON_PROG6  95.5,101.09 270 top
CON_PROG7  95.5,60.45 270 top
CON_PROG8  26.92,101.09 270 top
CON_PROG9  59.94,101.09 270 top
D1  12.7,28.45 180 top
D2  12.19,6.99 180 top
D3  45.21,6.99 180 top
D4  45.72,28.45 180 top
D5  81.03,6.99 180 top
D6  81.53,28.45 180 top
D7  12.19,47.62 180 top
D8  12.7,69.09 180 top
D9  45.21,47.62 180 top
D10  45.72,69.09 180 top
D11  80.77,47.62 180 top
D12  81.28,69.09 180 top
D13  12.19,88.27 180 top
D14  12.7,109.73 180 top
D15  45.21,88.27 180 top
D16  45.72,109.73 180 top
D17  80.77,88.27 180 top
D18  81.28,109.73 180 top
H1  5.08,125.48 0 top
H2  196.85,125.48 0 top
H3  5.08,5.08 0 top
H4  196.85,5.08 0 top
IC1  130.81,109.22 90 top
IC2  166.5,106.3 90 top
IC100  137.79,40.13 270 bottom
ISP  180.34,9.27 180 top
LCD  118.83,19.94 90 top
R1  185.17,85.6 0 top
R2  185.17,68.33 0 top
R3  134.62,66.17 0 top
R4  134.62,63.37 0 top
R5  134.75,60.33 180 top
R6  140.46,60.2 0 top
R7  185.17,51.05 0 top
R8  185.17,35.18 0 top
R9  12.7,34.29 270 top
R10  17.27,29.08 0 top
R11  12.19,12.83 270 top
R12  15.49,11.94 90 top
R13  45.21,12.83 270 top
R14  48.51,11.94 90 top
R15  45.72,34.29 270 top
R16  50.29,29.08 0 top
R17  81.03,12.83 270 top
R18  84.33,11.94 90 top
R19  81.53,34.29 270 top
R20  86.11,29.08 0 top
R21  12.19,53.47 270 top
R22  15.49,52.58 90 top
R23  12.7,74.93 270 top
R24  17.27,69.72 0 top
R25  45.21,53.47 270 top
R26  48.51,52.58 90 top
R27  45.72,74.93 270 top
R28  50.29,69.72 0 top
R29  80.77,53.47 270 top
R30  84.07,52.58 90 top
R31  81.28,74.93 270 top
R32  85.85,69.72 0 top
R33  12.19,94.11 270 top
R34  15.49,93.22 90 top
R35  12.7,115.57 270 top
R36  17.27,110.36 0 top
R37  45.21,94.11 270 top
R38  48.51,93.22 90 top
R39  45.72,115.57 270 top
R40  50.29,110.36 0 top
R41  80.77,94.11 270 top
R42  84.07,93.22 90 top
R43  81.28,115.57 270 top
R44  85.85,110.36 0 top
SUPPLY  182.5,122.43 90 top
T1  186.69,77.47 90 top
T2  186.69,60.96 90 top
T3  186.69,44.45 90 top
T4  186.69,27.94 90 top
U1  18.67,22.61 0 top
U2  19.94,13.34 90 top
U3  52.96,13.34 90 top
U4  51.69,22.61 0 top
U5  88.77,13.34 90 top
U6  87.5,22.61 0 top
U7  19.94,53.98 90 top
U8  18.67,63.25 0 top
U9  52.96,53.98 90 top
U10  51.69,63.25 0 top
U11  88.52,53.98 90 top
U12  87.25,63.25 0 top
U13  19.94,94.61 90 top
U14  18.67,103.89 0 top
U15  52.96,94.61 90 top
U16  51.69,103.89 0 top
U17  88.52,94.61 90 top
U18  87.25,103.89 0 top

### Tracks (layer width: path | path; a pad name or v marks a point on that pad's centre or on a via)
+3V3
  Top 0.406: CON_PROG8.1 28.73,121.7 29.08,122.04 | CON_PROG4.1 28.73,78.01 29.08,78.35 | CON_PROG5.1 61.75,78.52 62.1,78.86 | CON_PROG7.1 97.31,79.03 97.66,79.37 | CON_PROG2.1 61.75,39.4 62.1,39.75 | CON_PROG3.1 97.31,38.39 97.4,38.48 | CON_PROG1.1 28.73,39.4 29.21,39.88 | CON_PROG9.1 61.75,121.7 62.1,122.04 | CON_PROG6.1 97.31,121.19 97.66,121.53
  Top 0.61: 97.66,121.53 100.08,123.95 | 100.08,123.95 113.28,123.95 | 113.28,123.95 C1.+ | 62.1,122.04 64.01,123.95 | 64.01,123.95 100.08,123.95 | 29.08,122.04 30.99,123.95 64.01,123.95 | 29.08,78.35 32,81.28 64.52,81.28 | 64.52,81.28 99.57,81.28 | 99.57,81.28 110.24,81.28 111.76,82.8 | 111.76,82.8 111.76,122.43 113.28,123.95 | 62.1,78.86 64.52,81.28 | 97.66,79.37 99.57,81.28 | 29.08,39.75 29.21,39.88 30.99,41.66 64.01,41.66 | 64.01,41.66 100.58,41.66 | 100.58,41.66 109.22,41.66 111.76,44.2 111.76,82.8 | 62.1,39.75 64.01,41.66 | 97.4,38.48 100.58,41.66
  Top 1.27: IC1.3 129.58,116.05 C1.+
+5V  (via drill 0.6 pad 1.42)
  Top 0.406: U1.4 19.62,25.09 | 19.62,25.09 18.8,25.91 17.78,25.91 17.27,26.42 17.27,34.54 16.26,35.56 12.85,35.56 R9.1 | R11.1 12.19,14.73 13.21,15.75 17.78,15.75 18.64,14.89 U2.4 18.64,17.11 v18.8,17.27 | v21.34,28.45 19.62,26.73 19.62,25.09 | U4.4 52.64,25.09 | 52.64,25.09 51.82,25.91 50.8,25.91 50.29,26.42 50.29,34.54 49.28,35.56 45.87,35.56 R15.1 | R13.1 45.21,14.73 46.23,15.75 50.8,15.75 51.66,14.89 U3.4 51.66,17.11 v51.82,17.27 | v54.36,28.45 52.64,26.73 52.64,25.09 | U6.4 88.45,25.09 | 88.45,25.09 87.63,25.91 86.61,25.91 86.11,26.42 86.11,34.54 85.09,35.56 81.69,35.56 R19.1 | R17.1 81.03,14.73 82.04,15.75 86.61,15.75 87.47,14.89 U5.4 87.47,17.11 v87.63,17.27 | v90.17,28.45 88.45,26.73 88.45,25.09 | U8.4 19.62,65.72 | 19.62,65.72 18.8,66.55 17.78,66.55 17.27,67.06 17.27,75.18 16.26,76.2 12.85,76.2 R23.1 | R21.1 12.19,55.37 13.21,56.39 17.78,56.39 18.64,55.53 U7.4 18.64,57.76 v18.8,57.91 | v21.34,69.09 19.62,67.37 19.62,65.72 | U10.4 52.64,65.72 | 52.64,65.72 51.82,66.55 50.8,66.55 50.29,67.06 50.29,75.18 49.28,76.2 45.87,76.2 R27.1 | R25.1 45.21,55.37 46.23,56.39 50.8,56.39 51.66,55.53 U9.4 51.66,57.76 v51.82,57.91 | v54.36,69.09 52.64,67.37 52.64,65.72 | U12.4 88.2,65.72 | 88.2,65.72 87.38,66.55 86.36,66.55 85.85,67.06 85.85,75.18 84.84,76.2 81.43,76.2 R31.1 | R29.1 80.77,55.37 81.79,56.39 86.36,56.39 87.22,55.53 U11.4 87.22,57.76 v87.38,57.91 | v89.92,69.09 88.2,67.37 88.2,65.72 | U14.4 19.62,106.36 | 19.62,106.36 18.8,107.19 17.78,107.19 17.27,107.7 17.27,115.82 16.26,116.84 12.85,116.84 R35.1 | R33.1 12.19,96.01 13.21,97.03 17.78,97.03 18.64,96.17 U13.4 18.64,98.39 v18.8,98.55
  Top 0.406: v21.34,109.73 19.62,108.01 19.62,106.36 | U16.4 52.64,106.36 | 52.64,106.36 51.82,107.19 50.8,107.19 50.29,107.7 50.29,115.82 49.28,116.84 45.87,116.84 R39.1 | R37.1 45.21,96.01 46.23,97.03 50.8,97.03 51.66,96.17 U15.4 51.66,98.39 v51.82,98.55 | v54.36,109.73 52.64,108.01 52.64,106.36 | U18.4 88.2,106.36 | 88.2,106.36 87.38,107.19 86.36,107.19 85.85,107.7 85.85,115.82 84.84,116.84 81.43,116.84 R43.1 | R41.1 80.77,96.01 81.79,97.03 86.36,97.03 87.22,96.17 U17.4 87.22,98.39 v87.38,98.55 | v89.92,109.73 88.2,108.01 88.2,106.36
  Top 0.61: C5.1 144.9,41.4 IC100.7 139.45,41.4 139.19,41.66 | 139.19,41.66 139.19,60.05 R6.1 138.91,60.33 R5.1 136.04,60.45 R4.2 R3.2 136.14,66.27 136.14,69.09 v135.64,69.6 | ISP.2 185.29,8 186.59,9.3 R8.2 R7.2 R2.2 R1.2 186.59,92.61 186.94,92.96 | v100.08,28.45 109.22,28.45 113.79,23.88 117.43,23.88 LCD.3 LCD.2 | IC100.20 137.92,36.32 138.68,37.08 138.68,41.15 139.19,41.66
  Top 1.27: R3.2 170.31,66.17 172.21,68.07 v172.21,83.82 172.21,91.95 173.23,92.96 186.94,92.96 193.55,92.96 195.58,95 195.58,104.65 194.74,105.49 C4.+ 189.06,106.3 IC2.2
  Bottom 0.406: v18.8,17.27 18.8,25.91 v21.34,28.45 | v51.82,17.27 51.82,25.91 v54.36,28.45 | v87.63,17.27 87.63,25.91 v90.17,28.45 | v18.8,57.91 18.8,66.55 v21.34,69.09 | v51.82,57.91 51.82,66.55 v54.36,69.09 | v87.38,57.91 87.38,66.55 v89.92,69.09 | v18.8,98.55 18.8,107.19 v21.34,109.73 | v51.82,98.55 51.82,107.19 v54.36,109.73 | v87.38,98.55 87.38,107.19 v89.92,109.73
  Bottom 0.61: v21.34,109.73 v54.36,109.73 v89.92,109.73 114.3,109.73 115.32,108.71 115.32,71.12 116.33,70.1 135.13,70.1 v135.64,69.6 | v18.8,98.55 21.34,96.01 v21.34,69.09 v54.36,69.09 v89.92,69.09 | v18.8,57.91 21.34,55.37 v21.34,28.45 v54.36,28.45 v90.17,28.45 v100.08,28.45
+12V
  Top 1.27: IC2.3 C3.+ | SUPPLY.L2 183.45,117.86 | 183.45,117.86 183.45,113.47 IC2.3 | IC2.3 179.83,111.76 | 183.45,117.86 167.96,117.86 C2.+ 167.45,118.36 139.7,118.36 137.16,115.82 137.16,111.78 IC1.2
B1_BAT1+
  Top 0.406: U2.3 21.84,14.29 | 21.84,14.29 24.96,14.29 C7.1 | 21.84,14.29 21.84,18.29 22.62,19.06 CON_PROG1.14
B1_BAT1+1
  Top 0.406: U3.3 54.86,14.29 | 54.86,14.29 57.98,14.29 C8.1 | 54.86,14.29 54.86,18.29 55.64,19.06 CON_PROG2.14
B1_BAT1+3
  Top 0.406: U5.3 90.68,14.29 | 90.68,14.29 93.8,14.29 C10.1 | 90.68,14.29 90.68,18.29 91.45,19.06 CON_PROG3.14
B1_BAT1+4
  Top 0.406: U7.3 21.84,54.92 | 21.84,54.92 24.96,54.92 C12.1 | 21.84,54.92 21.84,58.93 22.35,59.44 22.43,59.51 22.62,59.7 CON_PROG4.14
B1_BAT1+5
  Top 0.406: U11.3 90.42,54.92 | 90.42,54.92 93.54,54.92 C16.1 | 90.42,54.92 90.42,58.93 91.2,59.7 CON_PROG7.14
B1_BAT1+6
  Top 0.406: U9.3 54.86,54.92 | 54.86,54.92 57.98,54.92 C14.1 | 54.86,54.92 54.86,58.93 55.64,59.7 CON_PROG5.14
B1_BAT1+7
  Top 0.406: U17.3 90.42,95.56 | 90.42,95.56 93.54,95.56 C22.1 | 90.42,95.56 90.42,99.57 91.2,100.34 CON_PROG6.14
B1_BAT1+9
  Top 0.406: U13.3 21.84,95.56 | 21.84,95.56 24.96,95.56 C18.1 | 21.84,95.56 21.84,99.57 22.62,100.34 CON_PROG8.14
B1_BAT1+10
  Top 0.406: U15.3 54.86,95.56 | 54.86,95.56 57.98,95.56 C20.1 | 54.86,95.56 54.86,99.57 55.64,100.34 CON_PROG9.14
B1_BAT2+
  Top 0.406: 21.84,21.34 21.84,20.32 22.35,19.81 22.49,19.67 22.6,19.56 CON_PROG1.15 | 21.84,21.34 21.84,22.6 C6.1 | U1.3 21.81,21.31 21.84,21.34
B1_BAT2+1
  Top 0.406: 54.86,21.34 54.86,20.32 55.62,19.56 CON_PROG2.15 | 54.86,21.34 54.86,22.6 C9.1 | U4.3 54.83,21.31 54.86,21.34
B1_BAT2+2
  Top 0.406: 90.68,21.34 90.68,20.32 91.44,19.56 CON_PROG3.15 | 90.68,21.34 90.68,22.6 C11.1 | U6.3 90.65,21.31 90.68,21.34
B1_BAT2+3
  Top 0.406: 21.84,61.98 21.84,60.96 22.6,60.2 CON_PROG4.15 | 21.84,61.98 21.84,63.24 C13.1 | U8.3 21.81,61.95 21.84,61.98
B1_BAT2+4
  Top 0.406: 54.86,61.98 54.86,60.96 55.62,60.2 CON_PROG5.15 | 54.86,61.98 54.86,63.24 C15.1 | U10.3 54.83,61.95 54.86,61.98
B1_BAT2+5
  Top 0.406: 90.42,61.98 90.42,60.96 91.18,60.2 CON_PROG7.15 | 90.42,61.98 90.42,63.24 C17.1 | U12.3 90.39,61.95 90.42,61.98
B1_BAT2+6
  Top 0.406: 21.84,102.62 21.84,101.6 22.6,100.84 CON_PROG8.15 | 21.84,102.62 21.84,103.88 C19.1 | U14.3 21.81,102.59 21.84,102.62
B1_BAT2+7
  Top 0.406: 54.86,102.62 54.86,101.6 55.62,100.84 CON_PROG9.15 | 54.86,102.62 54.86,103.88 C21.1 | U16.3 54.83,102.59 54.86,102.62
B1_BAT2+8
  Top 0.406: 90.42,102.62 90.42,101.6 91.18,100.84 CON_PROG6.15 | 90.42,102.62 90.42,103.88 C23.1 | U18.3 90.39,102.59 90.42,102.62
DB4
  Top 0.813: IC100.23 117.69,43.94 LCD.11
DB5
  Top 0.813: IC100.24 120.23,46.48 LCD.12
DB6
  Top 0.813: IC100.25 117.69,49.02 LCD.13
DB7
  Top 0.813: IC100.26 120.23,51.56 LCD.14
EN  (1 unrouted)
  Top 0.61: IC100.13 137.41,26.16 136.14,27.43 124.46,27.43 123.95,27.94 123.95,30.99 123.44,31.5 119.89,31.5
GND  (via drill 0.6 pad 1.42)  (1 unrouted)
  Top 0.406: R26.2 54.2,54 54.36,53.85 55.88,53.85 56.39,53.34 | U10.2 51.69,60.07 51.82,59.94 | R34.2 21.21,94.64 U13.2 22.73,94.61 23.37,93.98 | R38.2 54.23,94.64 U15.2 55.75,94.61 56.39,93.98 | U16.2 51.69,100.71 51.82,100.58 | U18.2 87.25,100.71 87.38,100.58 | R42.2 89.79,94.64 U17.2 90.81,94.61 91.44,93.98 | U8.2 18.67,60.07 18.8,59.94 | R22.2 21.21,54 U7.2 22.73,53.98 23.37,53.34 | U12.2 87.25,60.07 87.38,59.94 | R30.2 89.79,54 U11.2 91.31,53.98 91.95,53.34 | U6.2 87.5,19.43 87.38,19.3 | R18.2 90.05,13.36 U5.2 91.31,13.34 91.95,12.7 | U4.2 51.69,19.43 51.82,19.3 | R14.2 54.23,13.36 U3.2 56.26,13.34 56.39,13.21 | U1.2 18.67,19.94 18.8,19.81 | R12.2 21.21,13.36 U2.2 22.73,13.34 23.37,12.7 | U14.2 18.67,101.22 18.8,101.09 | CON_PROG6.5 98.8,101.34 99.06,101.6 | CON_PROG6.3 99.33,102.34 | 99.33,102.34 99.57,102.11 | CON_PROG9.16 CON_PROG9.5 63.5,101.34 | 63.5,101.34 63.75,101.34 64.01,101.6 | CON_PROG9.6 63,100.84 63.5,101.34 | CON_PROG6.16 99.31,101.34 | 99.31,101.34 99.57,101.6 | CON_PROG6.6 98.81,100.84 99.31,101.34 | CON_PROG6.2 98.83,102.84 99.33,102.34 | CON_PROG9.2 63.78,102.84 64.01,102.62 63.73,102.34 CON_PROG9.3 | CON_PROG8.16 CON_PROG8.5 30.73,101.34 30.99,101.6 | CON_PROG8.6 30.74,100.84 30.99,101.09 | CON_PROG8.3 30.75,102.34 30.99,102.11 | CON_PROG8.2 30.71,102.84 30.99,103.12 | CON_PROG7.6 99.32,60.2 99.57,60.45 99.82,60.7 CON_PROG7.5 CON_PROG7.16 | CON_PROG7.3 99.84,61.7 100.08,61.47 | CON_PROG7.2 99.29,62.2 99.57,62.48 | CON_PROG5.2 63.73,62.2 64.01,62.48 | CON_PROG5.3 63.77,61.7 64.01,61.47 | CON_PROG5.6 63.76,60.2 64.01,60.45 | CON_PROG5.16 CON_PROG5.5 63.75,60.7 64.01,60.96 | CON_PROG4.2 30.76,62.2 30.99,61.98 30.71,61.7 CON_PROG4.3
  Top 0.406: CON_PROG4.6 30.99,60.2 | 30.99,60.2 31.25,60.2 31.5,60.45 | 30.99,60.2 30.49,60.7 CON_PROG4.5 CON_PROG4.16 | CON_PROG1.2 31.27,21.56 31.5,21.34 31.22,21.06 CON_PROG1.3 | CON_PROG1.6 31.25,19.56 31.5,19.81 | CON_PROG1.16 CON_PROG1.5 30.74,20.06 30.99,19.81 | CON_PROG2.2 63.78,21.56 64.01,21.34 | CON_PROG2.6 64.01,19.56 | 64.01,19.56 64.77,19.56 65.02,19.81 | CON_PROG2.3 63.77,21.06 64.01,20.83 | 64.01,19.56 63.51,20.06 CON_PROG2.5 CON_PROG2.16 | CON_PROG3.2 99.85,21.56 100.08,21.34 99.8,21.06 CON_PROG3.3 | CON_PROG3.6 99.83,19.56 100.08,19.81 | 99.57,20.32 99.31,20.06 CON_PROG3.5 CON_PROG3.16
  other vias: 165.61,56.9 14.73,41.15 118.87,63.5
  pour Bottom (isolate 0.66): 0,0 0,130.56 202.18,130.56 202.18,0
  pour Top (isolate 0.66): 0,0 0,130.56 202.18,130.56 202.18,0
LEDA
  Top 0.61: LCD.15 121.79,54.23 123.95,56.39 123.95,58.93 125.35,60.33 R5.2
MISO  (via drill 0.6 pad 1.42)
  Top 0.61: ISP.9 132.21,13.08 v130.56,14.73 | v131.06,30.99 133.73,30.99 IC100.18
  Bottom 0.61: v130.56,14.73 130.56,30.48 v131.06,30.99
MOSI
  Top 0.61: ISP.1 181.61,18.54 180.85,19.3 153.42,19.3 146.81,25.91 146.81,29.46 146.3,29.97 137.16,29.97 136.14,28.96 134.24,28.96 IC100.17
N$1
  Top 0.406: D2.A R11.2
N$2
  Top 0.406: D1.A R9.2
N$3
  Top 0.406: D3.A R13.2
N$4
  Top 0.406: D4.A R15.2
N$5
  Top 0.406: D5.A R17.2
N$6
  Top 0.406: D6.A R19.2
N$7
  Top 0.406: D7.A R21.2
N$8
  Top 0.406: D8.A R23.2
N$9
  Top 0.406: D9.A R25.2
N$10
  Top 0.406: D10.A R27.2
N$11
  Top 0.406: D11.A R29.2
N$12
  Top 0.406: D12.A R31.2
N$13
  Top 0.406: D13.A R33.2
N$14
  Top 0.406: D14.A R35.2
N$15
  Top 0.406: D15.A R37.2
N$16
  Top 0.406: D16.A R39.2
N$17
  Top 0.406: D17.A R41.2
N$18
  Top 0.406: D18.A R43.2
N$19
  Top 0.406: 70.61,117.35 70.61,115.82 66.04,115.82 66.04,117.35
N$20
  Top 0.406: 106.68,117.35 106.68,115.82 102.11,115.82 102.11,117.35
N$21
  Top 0.406: 37.08,76.71 37.08,75.18 32.51,75.18 32.51,76.71
N$22
  Top 0.406: 71.12,76.71 71.12,75.18 66.55,75.18 66.55,76.71
N$23
  Top 0.406: 107.19,76.71 107.19,75.18 102.62,75.18 102.62,76.71
N$24
  Top 0.406: 37.59,36.07 37.59,34.54 33.02,34.54 33.02,36.07
N$25
  Top 0.406: 71.12,36.07 71.12,34.54 66.55,34.54 66.55,36.07
N$26
  Top 0.406: 106.68,36.07 106.68,34.54 102.11,34.54 102.11,36.07
N$27
  pour Top: 176.28,114.81 176.28,97.54 140.21,97.54 140.21,114.81
N$28
  Top 0.406: 35.56,117.35 35.56,115.82 30.99,115.82 30.99,117.35
PROG
  Top 0.406: U2.5 18.64,10.51 18.29,10.16 15.85,10.16 R12.1
PROG1
  Top 0.406: U1.5 16.73,23.91 15.85,24.79 R10.1
PROG2
  Top 0.406: U3.5 51.66,10.51 51.31,10.16 48.87,10.16 R14.1
PROG3
  Top 0.406: U4.5 49.75,23.91 48.87,24.79 R16.1
PROG4
  Top 0.406: U5.5 87.47,10.51 87.12,10.16 84.68,10.16 R18.1
PROG5
  Top 0.406: U6.5 85.57,23.91 84.68,24.79 R20.1
PROG6
  Top 0.406: U7.5 18.64,51.15 18.29,50.8 15.85,50.8 R22.1
PROG7
  Top 0.406: U8.5 16.73,64.55 15.85,65.43 R24.1
PROG8
  Top 0.406: U9.5 51.66,51.15 51.31,50.8 48.87,50.8 R26.1
PROG9
  Top 0.406: U10.5 49.75,64.55 48.87,65.43 R28.1
PROG10
  Top 0.406: U11.5 87.22,51.15 86.87,50.8 84.43,50.8 R30.1
PROG11
  Top 0.406: U12.5 85.31,64.55 84.43,65.43 R32.1
PROG12
  Top 0.406: U13.5 18.64,91.79 18.29,91.44 15.85,91.44 R34.1
PROG13
  Top 0.406: U14.5 16.73,105.19 15.85,106.07 R36.1
PROG14
  Top 0.406: U15.5 51.66,91.79 51.31,91.44 48.87,91.44 R38.1
PROG15
  Top 0.406: U16.5 49.75,105.19 48.87,106.07 R40.1
PROG16
  Top 0.406: U17.5 87.22,91.79 86.87,91.44 84.43,91.44 R42.1
PROG17
  Top 0.406: U18.5 85.31,105.19 84.43,106.07 R44.1
RESET  (via drill 0.6 pad 1.42)
  Top 0.61: R6.2 141.6,59.92 IC100.1 141.86,56.39 v149.35,56.39 | ISP.5 176.53,17.02 175.77,17.78 151.38,17.78 v149.86,19.3
  Bottom 0.61: v149.86,19.3 149.86,55.88 v149.35,56.39
RS
  Top 0.61: IC100.12 143.51,28.7 144.27,27.94 144.27,25.4 143.76,24.89 122.43,24.89 121.03,26.29 LCD.4
SCK  (via drill 0.6 pad 1.42)
  Top 0.61: ISP.7 173.99,16 173.74,16.26 133.1,16.26 v128.52,20.83 | v129.54,33.53 133.73,33.53 IC100.19
  Bottom 0.61: v128.52,20.83 128.52,32.51 v129.54,33.53
SCL  (via drill 0.6, 0.6 pad 1.42)
  Top 0.406: 33.45,100.15 v33.53,100.08 33.29,99.84 CON_PROG8.8 | v103.63,70.61 103.63,60.45 102.38,59.2 CON_PROG7.8 102.34,59.2 103.12,58.42 103.12,51.31 102.11,50.29 v101.6,50.29 | CON_PROG3.8 106.45,18.56 v106.68,18.8 | CON_PROG2.8 67.29,18.56 68.07,17.78 v68.07,9.65 | CON_PROG1.8 33.76,18.56 34.04,18.29 34.04,9.65 v34.54,9.14 | CON_PROG9.8 65.3,99.84 v65.53,100.08 | CON_PROG6.8 101.37,99.84 v101.6,100.08 | CON_PROG4.8 34.27,59.2 34.54,58.93 v34.54,50.29 | v66.55,50.29 66.55,58.42 65.77,59.2 CON_PROG5.8
  Top 0.61: IC100.28 130.81,56.64 v130.05,57.4 | v130.05,63.5 133.07,63.5 R4.1
  Bottom 0.406: v33.53,100.08 33.53,96.01 34.04,95.5 64.01,95.5 65.53,97.03 | v65.53,100.08 65.53,97.03 | 65.53,97.03 67.06,95.5 101.09,95.5 101.6,96.01 | 101.6,96.01 v101.6,100.08 | v130.05,63.5 130.05,67.06 128.52,68.58 103.63,68.58 | 103.63,68.58 102.62,68.58 101.6,69.6 101.6,96.01 | v103.63,70.61 103.63,68.58 | v130.05,57.4 130.05,55.37 128.52,53.85 109.22,53.85 106.68,51.31 v106.68,18.8 106.68,12.19 104.14,9.65 v68.07,9.65 67.56,9.14 v34.54,9.14 | v34.54,50.29 v66.55,50.29 v101.6,50.29
  Bottom 0.61: v130.05,57.4 v130.05,63.5
SDA  (via drill 0.6, 0.6 pad 1.42)
  Top 0.406: v101.6,54.86 101.6,57.91 100.8,58.71 100.79,58.7 CON_PROG7.9 | 31.2,99.35 v32,98.55 31.21,99.34 CON_PROG8.9 | v65.53,95 65.53,96.01 64.52,97.03 64.52,99.06 64.22,99.35 64.21,99.34 CON_PROG9.9 | v100.08,93.98 100.08,99.06 99.78,99.35 99.77,99.34 CON_PROG6.9 | v32.51,57.91 31.71,58.71 31.7,58.7 CON_PROG4.9 | v64.52,53.34 64.52,58.42 64.22,58.71 64.21,58.7 CON_PROG5.9 | v66.04,12.19 66.04,17.78 65.75,18.07 65.74,18.06 CON_PROG2.9 | v32.51,13.72 32.51,17.78 32.22,18.07 32.21,18.06 CON_PROG1.9 | v101.09,12.7 101.09,17.27 100.29,18.07 100.28,18.06 CON_PROG3.9
  Top 0.61: IC100.27 127.25,54.1 127,54.36 v127,57.4 | v127.51,66.04 133.07,66.04 R3.1
  Bottom 0.406: v32,98.55 32,95.5 33.02,94.49 65.02,94.49 v65.53,95 66.04,94.49 99.57,94.49 v100.08,93.98 100.08,67.56 | 100.08,67.56 100.08,61.47 101.6,59.94 v101.6,54.86 101.6,53.85 | v32.51,57.91 32.51,54.36 33.53,53.34 v64.52,53.34 101.09,53.34 101.6,53.85 | v32.51,13.72 34.04,12.19 v66.04,12.19 66.55,12.7 v101.09,12.7 103.63,12.7 104.14,13.21 104.14,51.31 101.6,53.85 | 100.08,67.56 125.98,67.56 v127.51,66.04
  Bottom 0.61: v127,57.4 127,65.53 v127.51,66.04
STAT
  Top 0.406: D2.C 19.97,5.24 21.34,6.6 21.34,12.29 U2.1
STAT1
  Top 0.406: U1.1 13.75,21.31 12.7,22.35 D1.C
STAT2
  Top 0.406: D3.C 52.99,5.24 54.36,6.6 54.36,12.29 U3.1
STAT3
  Top 0.406: U4.1 46.77,21.31 45.72,22.35 D4.C
STAT4
  Top 0.406: D5.C 88.8,5.24 90.17,6.6 90.17,12.29 U5.1
STAT5
  Top 0.406: U6.1 82.58,21.31 81.53,22.35 D6.C
STAT6
  Top 0.406: D7.C 19.97,45.88 21.34,47.24 21.34,52.93 U7.1
STAT7
  Top 0.406: U8.1 13.75,61.95 12.7,62.99 D8.C
STAT8
  Top 0.406: D9.C 52.99,45.88 54.36,47.24 54.36,52.93 U9.1
STAT9
  Top 0.406: U10.1 46.77,61.95 45.72,62.99 D10.C
STAT10
  Top 0.406: D11.C 88.55,45.88 89.92,47.24 89.92,52.93 U11.1
STAT11
  Top 0.406: U12.1 82.33,61.95 81.28,62.99 D12.C
STAT12
  Top 0.406: D13.C 19.97,86.52 21.34,87.88 21.34,93.57 U13.1
STAT13
  Top 0.406: U14.1 13.75,102.59 12.7,103.63 D14.C
STAT14
  Top 0.406: D15.C 52.99,86.52 54.36,87.88 54.36,93.57 U15.1
STAT15
  Top 0.406: U16.1 46.77,102.59 45.72,103.63 D16.C
STAT16
  Top 0.406: D17.C 88.55,86.52 89.92,87.88 89.92,93.57 U17.1
STAT17
  Top 0.406: U18.1 82.33,102.59 81.28,103.63 D18.C
T1
  Top 0.61: T1.B' 183.9,81.66 183.9,85.85 183.74,85.7 R1.1 | IC100.4 175.51,49.02 176.78,50.29 176.78,72.64 178.82,74.68 184.69,74.68
  Top 1.27: T1.B 184.69,74.68 T1.B'
T2
  Top 0.61: T2.B' 183.74,65.31 R2.1 | IC100.5 178.05,46.48 179.32,47.75 179.32,55.88 180.85,57.4 184.53,57.4 T2.B
  Top 1.27: T2.B' T2.B
T3
  Top 0.61: T3.B' 183.74,48.8 R7.1 | IC100.6 184.44,43.94 184.69,44.2
  Top 1.27: T3.B 184.69,44.2 T3.B'
T4
  Top 0.61: T4.B' 183.74,32.29 183.74,32.51 | 183.74,32.51 R8.1 | IC100.11 182.47,31.24 183.74,32.51
  Top 1.27: T4.B' T4.B 184.69,27.65

### Text on the board
Top: GND | VCC | mrShark Charger | version 1.0 | RIGHT | UP | DOWN | LEFT | NorthernStars | ISP
tDocu: LCD